# EasyEDA Pro project ProProject_扫描隧道显微镜OpenSTM_2023-08-25.epro, schematic PowerBoard
Create Date: 2022-12-16; Page Name: P1; Project Name: STM-New-Structure; Schematic Name: PowerBoard; Update Date: 2023-02-04; Add into BOM: yes; Convert to PCB: yes
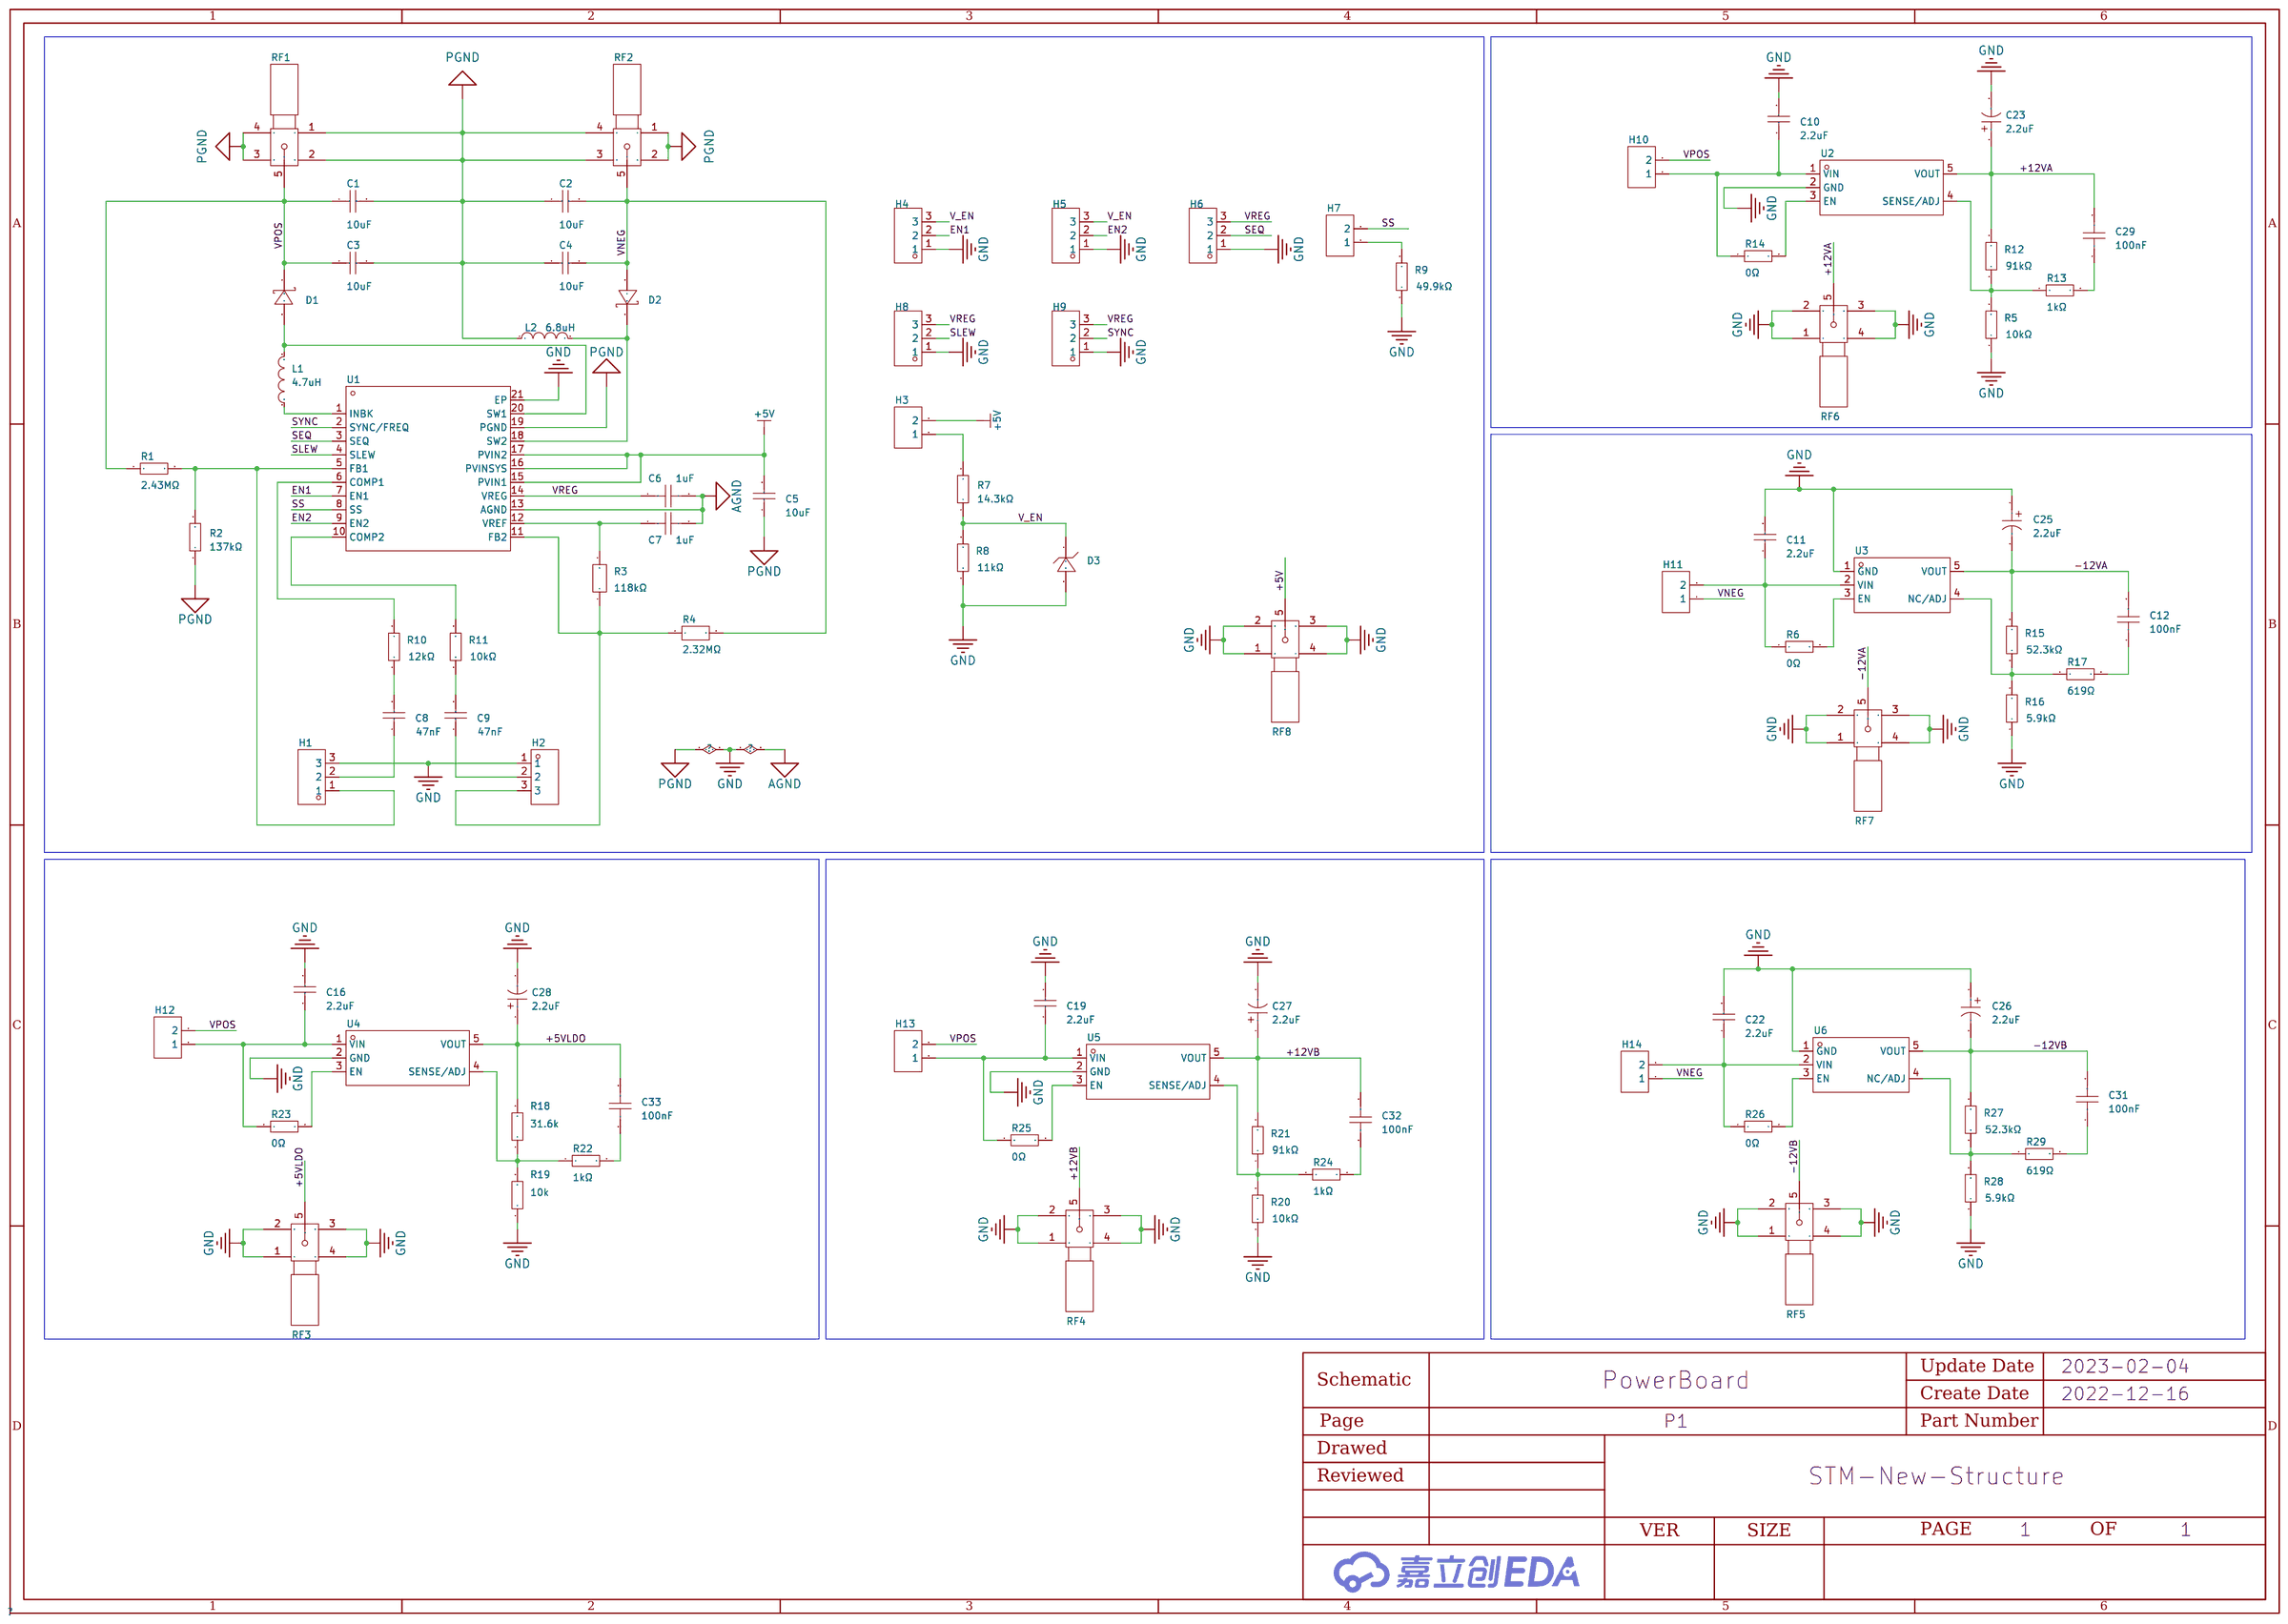
[diagram p3: schematic sheet]

## Parts
C1  10uF  [C1206]
C2  10uF  [C1206]
C3  10uF  [C1206]
C4  10uF  [C1206]
C5  10uF  [C1206]
C6  1uF  [C0603]
C7  1uF  [C0603]
C8  47nF  [C0603]
C9  47nF  [C0603]
C10  2.2uF  [C1206]
C11  2.2uF  [C1206]
C12  100nF  [C0603]
C16  2.2uF  [C1206]
C19  2.2uF  [C1206]
C22  2.2uF  [C1206]
C23  2.2uF  [CAP-SMD_L3.2-W1.6]
C25  2.2uF  [CAP-SMD_L3.2-W1.6]
C26  2.2uF  [CAP-SMD_L3.2-W1.6]
C27  2.2uF  [CAP-SMD_L3.2-W1.6]
C28  2.2uF  [CAP-SMD_L3.2-W1.6]
C29  100nF  [C0603]
C31  100nF  [C0603]
C32  100nF  [C0603]
C33  100nF  [C0603]
D1  DFLS240-7  [POWERDI-123_L2.8-W1.8-LS3.7-RD]
D2  DFLS240-7  [POWERDI-123_L2.8-W1.8-LS3.7-RD]
D3  MMSZ5233B-7-F  [SOD-123_L2.7-W1.6-LS3.7-RD]
H1  -  [HDR-TH_3P-P2.54-V-F]
H2  -  [HDR-TH_3P-P2.54-V-F]
H3  -  [HDR-TH_2P-P2.54-V-F]
H4  -  [HDR-TH_3P-P2.54-V-F]
H5  -  [HDR-TH_3P-P2.54-V-F]
H6  -  [HDR-TH_3P-P2.54-V-F]
H7  -  [HDR-TH_2P-P2.54-V-F]
H8  -  [HDR-TH_3P-P2.54-V-F]
H9  -  [HDR-TH_3P-P2.54-V-F]
H10  -  [HDR-TH_2P-P2.54-V-F]
H11  -  [HDR-TH_2P-P2.54-V-F]
H12  -  [HDR-TH_2P-P2.54-V-F]
H13  -  [HDR-TH_2P-P2.54-V-F]
H14  -  [HDR-TH_2P-P2.54-V-F]
L1  4.7uH  [IND-SMD_L5.4-W5.2]
L2  6.8uH  [IND-SMD_L7.0-W6.6]
R1  2.43MΩ  [R0603]
R2  137kΩ  [R0603]
R3  118kΩ  [R0603]
R4  2.32MΩ  [R0603]
R5  10kΩ  [R0603]
R6  0Ω  [R0603]
R7  14.3kΩ  [R0603]
R8  11kΩ  [R0603]
R9  49.9kΩ  [R0603]
R10  12kΩ  [R0603]
R11  10kΩ  [R0603]
R12  91kΩ  [R0603]
R13  1kΩ  [R0603]
R14  0Ω  [R0603]
R15  52.3kΩ  [R0603]
R16  5.9kΩ  [R0603]
R17  619Ω  [R0603]
R18  31.6k  [R0603]
R19  10k  [R0603]
R20  10kΩ  [R0603]
R21  91kΩ  [R0603]
R22  1kΩ  [R0603]
R23  0Ω  [R0603]
R24  1kΩ  [R0603]
R25  0Ω  [R0603]
R26  0Ω  [R0603]
R27  52.3kΩ  [R0603]
R28  5.9kΩ  [R0603]
R29  619Ω  [R0603]
RF1  BWSMA-KWE-Z001  [SMA-TH_BWSMA-KWE-Z001]
RF2  BWSMA-KWE-Z001  [SMA-TH_BWSMA-KWE-Z001]
RF3  BWSMA-KWE-Z001  [SMA-TH_BWSMA-KWE-Z001]
RF4  BWSMA-KWE-Z001  [SMA-TH_BWSMA-KWE-Z001]
RF5  BWSMA-KWE-Z001  [SMA-TH_BWSMA-KWE-Z001]
RF6  BWSMA-KWE-Z001  [SMA-TH_BWSMA-KWE-Z001]
RF7  BWSMA-KWE-Z001  [SMA-TH_BWSMA-KWE-Z001]
RF8  BWSMA-KWE-Z001  [SMA-TH_BWSMA-KWE-Z001]
U1  ADP5070ACPZ-R7  [LFCSP-20_L4.0-W4.0-P0.50-TL-EP2.6]
U2  ADP7118AUJZ-R7  [TSOT-23-5_L2.9-W1.6-P0.95-LS2.8-BR]
U3  ADP7182AUJZ-R7  [TSOT-23-5_L2.9-W1.6-P0.95-LS2.8-BR]
U4  ADP7118AUJZ-R7  [TSOT-23-5_L2.9-W1.6-P0.95-LS2.8-BR]
U5  ADP7118AUJZ-R7  [TSOT-23-5_L2.9-W1.6-P0.95-LS2.8-BR]
U6  ADP7182AUJZ-R7  [TSOT-23-5_L2.9-W1.6-P0.95-LS2.8-BR]

## Library data of the parts
C1-C5 = CL31A106KBHNNNE: 容值:10uF;精度:±10%;额定电压:50V;材质(温度系数):X5R;; LCSC Part Name: 10uF±10%50V; Supplier Part: C13585; Manufacturer: SAMSUNG(三星); Supplier Footprint: 1206; JLCPCB Part Class: BasicPart; Datasheet: https://atta.szlcsc.com/upload/public/pdf/source/20160103/1457707668742.pdf; Supplier: LCSC; Tolerance: ±10%; Voltage Rated: 50V; Temperature Coefficient: X5R
C6 C7 = CL10A105KL8NNNC: 容值:1uF;精度:±10%;额定电压:35V;材质(温度系数):-;; LCSC Part Name: 1uF±10%35V; Supplier Part: C478859; Manufacturer: SAMSUNG(三星); Supplier Footprint: 0603; JLCPCB Part Class: ExtendedPart; Datasheet: https://atta.szlcsc.com/upload/public/pdf/source/20200102/C478859_0EBF0387113597ECF4C91C52A34CAFD4.pdf; Supplier: LCSC; Tolerance: ±10%; Voltage Rated: 35V
C8 C9 = CL10B473KB8NNNC: 容值:47nF;精度:±10%;额定电压:50V;材质(温度系数):X7R;; LCSC Part Name: 47nF±10%50V; Supplier Part: C1622; Manufacturer: SAMSUNG(三星); Supplier Footprint: 0603; JLCPCB Part Class: BasicPart; Datasheet: https://atta.szlcsc.com/upload/public/pdf/source/20160103/1457707684971.pdf; Supplier: LCSC; Tolerance: ±10%; Voltage Rated: 50V; Temperature Coefficient: X7R
C10 C11 C16 C19 C22 = CL31B225KBHNNNE: 容值:2.2uF;精度:±10%;额定电压:50V;材质(温度系数):X7R;; LCSC Part Name: 2.2uF±10%50V; Supplier Part: C50254; Manufacturer: SAMSUNG(三星); Supplier Footprint: 1206; JLCPCB Part Class: BasicPart; Datasheet: https://atta.szlcsc.com/upload/public/pdf/source/20160103/1457707731300.pdf; Supplier: LCSC; Tolerance: ±10%; Voltage Rated: 50V; Temperature Coefficient: X7R
C12 C29 C31-C33 = CC0603KRX7R9BB104: 容值:100nF;精度:±10%;额定电压:50V;材质(温度系数):X7R;; LCSC Part Name: 100nF±10%50V; Supplier Part: C14663; Manufacturer: YAGEO(国巨); Supplier Footprint: 0603; JLCPCB Part Class: BasicPart; Datasheet: https://atta.szlcsc.com/upload/public/pdf/source/20180910/C282072_33301C7F631E79921B82A8DAC6BCC5B3.pdf; Supplier: LCSC; Tolerance: ±10%; Voltage Rated: 50V; Temperature Coefficient: X7R
C23 C25-C28 = T491A225M016AT: 容值:2.2uF;精度:±20%;额定电压:16V;漏电流:-;纹波电流:-;等效串联电阻:6Ω;工作温度:-55℃~+125℃;; LCSC Part Name: 2.2uF±20%16V; Supplier Part: C1953932; Manufacturer: KEMET(基美); Supplier Footprint: 1206; JLCPCB Part Class: ExtendedPart; Datasheet: https://atta.szlcsc.com/upload/public/pdf/source/20210416/95C0EC5B3581C9A90529545117ABEAC1.pdf; Supplier: LCSC; Tolerance: ±20%; Rated Voltage: 16V; Equivalent Series Resistance(ESR): 6Ω; Operating Temperature: -55℃~+125℃
D1 D2 = DFLS240-7: 直流反向耐压(Vr):40V;平均整流电流(Io):2A;正向压降(Vf):700mV@2A;; LCSC Part Name: 40V2A700mV@2A; Supplier Part: C124195; Manufacturer: DIODES(美台); Supplier Footprint: PowerDI-123; JLCPCB Part Class: ExtendedPart; Datasheet: https://atta.szlcsc.com/upload/public/pdf/source/20170804/C124195_1501836226603866204.pdf; Supplier: LCSC; Reverse Voltage (Vr): 40V; Average Rectified Current (Io): 2A; Forward Voltage (Vf@If): 700mV@2A
D3 = MMSZ5233B-7-F: 二极管配置:独立式;稳压值(标称值):6V;稳压值(范围):5.7V~6.3V;精度:-;功率:500mW;反向电流(Ir):5uA@3.5V;阻抗(Zzt):7Ω;; LCSC Part Name: 6V500mW; Supplier Part: C151381; Manufacturer: DIODES(美台); Supplier Footprint: SOD-123; JLCPCB Part Class: ExtendedPart; Datasheet: https://atta.szlcsc.com/upload/public/pdf/source/20171225/C151381_15141883629451203191.pdf; Supplier: LCSC; Diode Configuration: 独立式; Zener Voltage (Nom): 6V; Zener Voltage (Range): 5.7V~6.3V; Power Dissipation: 500mW; Reverse Leakage Current (Ir): 5uA@3.5V; Zener Impedance (Zzt): 7Ω
H1 H2 H4-H6 H8 H9 = HDR-F_2.54_1x3P: Supplier Part: C541850; Supplier Footprint: 插件
H3 H7 H10-H14 = HDR-F_2.54_1x2P: Supplier Part: C49661; Supplier Footprint: 插件
L1 = MWSA0503S-4R7MT: 电感值:4.7uH;精度:±20%;额定电流:4.5A;直流电阻(DCR):60mΩ;; LCSC Part Name: 4.7uH±20%4.5A60mΩ; Supplier Part: C408410; Manufacturer: Sunlord(顺络); Supplier Footprint: SMD; JLCPCB Part Class: ExtendedPart; Datasheet: https://atta.szlcsc.com/upload/public/pdf/source/20190729/C408410_8AE9F4BE330F0D24FED3825A68E3306A.pdf; Supplier: LCSC; Tolerance: ±20%; Rated Current: 4.5A; DC Resistance (DCR): 60mΩ
L2 = MWSA0603S-6R8MT: 电感值:6.8uH;精度:±20%;额定电流:5A;直流电阻(DCR):48mΩ;; LCSC Part Name: 6.8uH±20%5A48mΩ; Supplier Part: C408449; Manufacturer: Sunlord(顺络); Supplier Footprint: SMD; JLCPCB Part Class: ExtendedPart; Datasheet: https://atta.szlcsc.com/upload/public/pdf/source/20190729/C408449_00E8ADA0E11DB85AE9F292F565DACFA0.pdf; Supplier: LCSC; Tolerance: ±20%; Rated Current: 5A; DC Resistance (DCR): 48mΩ
R1 = RS-03L2434FT: 阻值:2.43MΩ;精度:±1%;功率:100mW;温度系数:±250ppm/℃;最大工作电压:50V;工作温度范围:-55℃~+155℃;; LCSC Part Name: 2.43MΩ±1%100mW; Supplier Part: C322108; Manufacturer: FH(风华); Supplier Footprint: 0603; JLCPCB Part Class: ExtendedPart; Datasheet: https://atta.szlcsc.com/upload/public/pdf/source/20181211/C322108_00DFEDFB5C93DEA336AB14E1914F72A4.pdf; Supplier: LCSC; Tolerance: ±1%; Power(Watts): 100mW; Temperature Coefficient: ±250ppm/℃; Overload Voltage (Max): 50V; Operating Temperature Range: -55℃~+155℃
R2 = 0603WAF1373T5E: 电阻类型:厚膜电阻;阻值:137kΩ;精度:±1%;功率:100mW;温度系数:±100ppm/℃;最大工作电压:75V;工作温度范围:-55℃~+155℃;; LCSC Part Name: 137kΩ±1%100mW; Supplier Part: C22872; Manufacturer: UNI-ROYAL(厚声); Supplier Footprint: 0603; JLCPCB Part Class: ExtendedPart; Datasheet: https://atta.szlcsc.com/upload/public/pdf/source/20200306/C422600_1E6D84923E4A46A82E41ADD87F860B5C.pdf; Supplier: LCSC; Type: 厚膜电阻; Tolerance: ±1%; Power(Watts): 100mW; Temperature Coefficient: ±100ppm/℃; Overload Voltage (Max): 75V; Operating Temperature Range: -55℃~+155℃
R3 = ERJ3EKF1183V: 电阻类型:厚膜电阻;阻值:118kΩ;精度:±1%;功率:100mW;温度系数:±100ppm/℃;最大工作电压:-;工作温度范围:-55℃~+155℃;; LCSC Part Name: 118kΩ±1%100mW; Supplier Part: C402896; Manufacturer: PANASONIC(松下); Supplier Footprint: 0603; JLCPCB Part Class: ExtendedPart; Datasheet: https://atta.szlcsc.com/upload/public/pdf/source/20190709/C402896_051BAD9E0EE94628DA6EDCE940A23B71.pdf; Supplier: LCSC; Type: 厚膜电阻; Tolerance: ±1%; Power(Watts): 100mW; Temperature Coefficient: ±100ppm/℃; Operating Temperature Range: -55℃~+155℃
R4 = RC0603FR-072M32L: 阻值:2.32MΩ;精度:±1%;功率:100mW;温度系数:±100ppm/℃;最大工作电压:75V;工作温度范围:-55℃~+155℃;; LCSC Part Name: 2.32MΩ±1%100mW; Supplier Part: C482791; Manufacturer: YAGEO(国巨); Supplier Footprint: 0603; JLCPCB Part Class: ExtendedPart; Datasheet: https://atta.szlcsc.com/upload/public/pdf/source/20200715/C482791_BF3B93AC40CF51E6746C24A7611E3F1E.pdf; Supplier: LCSC; Tolerance: ±1%; Power(Watts): 100mW; Temperature Coefficient: ±100ppm/℃; Overload Voltage (Max): 75V; Operating Temperature Range: -55℃~+155℃
R5 R11 R20 = 0603WAF1002T5E: 电阻类型:厚膜电阻;阻值:10kΩ;精度:±1%;功率:100mW;温度系数:±100ppm/℃;最大工作电压:75V;工作温度范围:-55℃~+155℃;; LCSC Part Name: 10kΩ±1%100mW; Supplier Part: C25804; Manufacturer: UNI-ROYAL(厚声); Supplier Footprint: 0603; JLCPCB Part Class: BasicPart; Datasheet: https://atta.szlcsc.com/upload/public/pdf/source/20200306/C422600_1E6D84923E4A46A82E41ADD87F860B5C.pdf; Supplier: LCSC; Type: 厚膜电阻; Tolerance: ±1%; Power(Watts): 100mW; Temperature Coefficient: ±100ppm/℃; Overload Voltage (Max): 75V; Operating Temperature Range: -55℃~+155℃
R6 R14 R23 R25 R26 = 0603WAF0000T5E: 电阻类型:厚膜电阻;阻值:0Ω;精度:±1%;功率:100mW;最大工作电压:75V;工作温度范围:-55℃~+155℃;; LCSC Part Name: 0Ω±1%100mW; Supplier Part: C21189; Manufacturer: UNI-ROYAL(厚声); Supplier Footprint: 0603; JLCPCB Part Class: BasicPart; Datasheet: https://atta.szlcsc.com/upload/public/pdf/source/20200306/C422600_1E6D84923E4A46A82E41ADD87F860B5C.pdf; Supplier: LCSC; Type: 厚膜电阻; Tolerance: ±1%; Power(Watts): 100mW; Overload Voltage (Max): 75V; Operating Temperature Range: -55℃~+155℃
R7 = 0603WAF1432T5E: 电阻类型:厚膜电阻;阻值:14.3kΩ;精度:±1%;功率:100mW;温度系数:±100ppm/℃;最大工作电压:75V;工作温度范围:-55℃~+155℃;; LCSC Part Name: 14.3kΩ±1%100mW; Supplier Part: C22799; Manufacturer: UNI-ROYAL(厚声); Supplier Footprint: 0603; JLCPCB Part Class: ExtendedPart; Datasheet: https://atta.szlcsc.com/upload/public/pdf/source/20200306/C422600_1E6D84923E4A46A82E41ADD87F860B5C.pdf; Supplier: LCSC; Type: 厚膜电阻; Tolerance: ±1%; Power(Watts): 100mW; Temperature Coefficient: ±100ppm/℃; Overload Voltage (Max): 75V; Operating Temperature Range: -55℃~+155℃
R8 = 0603WAF1102T5E: 电阻类型:厚膜电阻;阻值:11kΩ;精度:±1%;功率:100mW;温度系数:±100ppm/℃;最大工作电压:75V;工作温度范围:-55℃~+155℃;; LCSC Part Name: 11kΩ±1%100mW; Supplier Part: C25950; Manufacturer: UNI-ROYAL(厚声); Supplier Footprint: 0603; JLCPCB Part Class: BasicPart; Datasheet: https://atta.szlcsc.com/upload/public/pdf/source/20200306/C422600_1E6D84923E4A46A82E41ADD87F860B5C.pdf; Supplier: LCSC; Type: 厚膜电阻; Tolerance: ±1%; Power(Watts): 100mW; Temperature Coefficient: ±100ppm/℃; Overload Voltage (Max): 75V; Operating Temperature Range: -55℃~+155℃
R9 = 0603WAF4992T5E: 电阻类型:厚膜电阻;阻值:49.9kΩ;精度:±1%;功率:100mW;温度系数:±100ppm/℃;最大工作电压:75V;工作温度范围:-55℃~+155℃;; LCSC Part Name: 49.9kΩ±1%100mW; Supplier Part: C23184; Manufacturer: UNI-ROYAL(厚声); Supplier Footprint: 0603; JLCPCB Part Class: BasicPart; Datasheet: https://atta.szlcsc.com/upload/public/pdf/source/20200306/C422600_1E6D84923E4A46A82E41ADD87F860B5C.pdf; Supplier: LCSC; Type: 厚膜电阻; Tolerance: ±1%; Power(Watts): 100mW; Temperature Coefficient: ±100ppm/℃; Overload Voltage (Max): 75V; Operating Temperature Range: -55℃~+155℃
R10 = 0603WAF1202T5E: 电阻类型:厚膜电阻;阻值:12kΩ;精度:±1%;功率:100mW;温度系数:±100ppm/℃;最大工作电压:75V;工作温度范围:-55℃~+155℃;; LCSC Part Name: 12kΩ±1%100mW; Supplier Part: C22790; Manufacturer: UNI-ROYAL(厚声); Supplier Footprint: 0603; JLCPCB Part Class: BasicPart; Datasheet: https://atta.szlcsc.com/upload/public/pdf/source/20200306/C422600_1E6D84923E4A46A82E41ADD87F860B5C.pdf; Supplier: LCSC; Type: 厚膜电阻; Tolerance: ±1%; Power(Watts): 100mW; Temperature Coefficient: ±100ppm/℃; Overload Voltage (Max): 75V; Operating Temperature Range: -55℃~+155℃
R12 R21 = 0603WAF9102T5E: 电阻类型:厚膜电阻;阻值:91kΩ;精度:±1%;功率:100mW;温度系数:±100ppm/℃;最大工作电压:75V;工作温度范围:-55℃~+155℃;; LCSC Part Name: 91kΩ±1%100mW; Supplier Part: C23265; Manufacturer: UNI-ROYAL(厚声); Supplier Footprint: 0603; JLCPCB Part Class: BasicPart; Datasheet: https://atta.szlcsc.com/upload/public/pdf/source/20200306/C422600_1E6D84923E4A46A82E41ADD87F860B5C.pdf; Supplier: LCSC; Type: 厚膜电阻; Tolerance: ±1%; Power(Watts): 100mW; Temperature Coefficient: ±100ppm/℃; Overload Voltage (Max): 75V; Operating Temperature Range: -55℃~+155℃
R13 R22 R24 = 0603WAF1001T5E: 电阻类型:厚膜电阻;阻值:1kΩ;精度:±1%;功率:100mW;温度系数:±100ppm/℃;最大工作电压:75V;工作温度范围:-55℃~+155℃;; LCSC Part Name: 1kΩ±1%100mW; Supplier Part: C21190; Manufacturer: UNI-ROYAL(厚声); Supplier Footprint: 0603; JLCPCB Part Class: BasicPart; Datasheet: https://atta.szlcsc.com/upload/public/pdf/source/20200306/C422600_1E6D84923E4A46A82E41ADD87F860B5C.pdf; Supplier: LCSC; Type: 厚膜电阻; Tolerance: ±1%; Power(Watts): 100mW; Temperature Coefficient: ±100ppm/℃; Overload Voltage (Max): 75V; Operating Temperature Range: -55℃~+155℃
R15 R27 = 0603WAF5232T5E: 电阻类型:厚膜电阻;阻值:52.3kΩ;精度:±1%;功率:100mW;温度系数:±100ppm/℃;最大工作电压:75V;工作温度范围:-55℃~+155℃;; LCSC Part Name: 52.3kΩ±1%100mW; Supplier Part: C23198; Manufacturer: UNI-ROYAL(厚声); Supplier Footprint: 0603; JLCPCB Part Class: ExtendedPart; Datasheet: https://atta.szlcsc.com/upload/public/pdf/source/20200306/C422600_1E6D84923E4A46A82E41ADD87F860B5C.pdf; Supplier: LCSC; Type: 厚膜电阻; Tolerance: ±1%; Power(Watts): 100mW; Temperature Coefficient: ±100ppm/℃; Overload Voltage (Max): 75V; Operating Temperature Range: -55℃~+155℃
R16 R28 = 0603WAF5901T5E: 电阻类型:厚膜电阻;阻值:5.9kΩ;精度:±1%;功率:100mW;温度系数:±100ppm/℃;最大工作电压:75V;工作温度范围:-55℃~+155℃;; LCSC Part Name: 5.9kΩ±1%100mW; Supplier Part: C23071; Manufacturer: UNI-ROYAL(厚声); Supplier Footprint: 0603; JLCPCB Part Class: ExtendedPart; Datasheet: https://atta.szlcsc.com/upload/public/pdf/source/20200306/C422600_1E6D84923E4A46A82E41ADD87F860B5C.pdf; Supplier: LCSC; Type: 厚膜电阻; Tolerance: ±1%; Power(Watts): 100mW; Temperature Coefficient: ±100ppm/℃; Overload Voltage (Max): 75V; Operating Temperature Range: -55℃~+155℃
R17 R29 = 0603WAF6190T5E: 电阻类型:厚膜电阻;阻值:619Ω;精度:±1%;功率:100mW;温度系数:±100ppm/℃;最大工作电压:75V;工作温度范围:-55℃~+155℃;; LCSC Part Name: 619Ω±1%100mW; Supplier Part: C23218; Manufacturer: UNI-ROYAL(厚声); Supplier Footprint: 0603; JLCPCB Part Class: ExtendedPart; Datasheet: https://atta.szlcsc.com/upload/public/pdf/source/20200306/C422600_1E6D84923E4A46A82E41ADD87F860B5C.pdf; Supplier: LCSC; Type: 厚膜电阻; Tolerance: ±1%; Power(Watts): 100mW; Temperature Coefficient: ±100ppm/℃; Overload Voltage (Max): 75V; Operating Temperature Range: -55℃~+155℃
R18 = 0603WAF3162T5E: 电阻类型:厚膜电阻;阻值:31.6k;精度:±1%;功率:1/10W;温度系数:±100ppm/;最大工作电压:75V;工作温度范围:-55~+155;; LCSC Part Name: 31.6k ±1%; Supplier Part: C25967; Manufacturer: UNI-ROYAL(厚声); Supplier Footprint: 0603; JLCPCB Part Class: ExtendedPart; Datasheet: https://atta.szlcsc.com/upload/public/pdf/source/20200306/C422600_1E6D84923E4A46A82E41ADD87F860B5C.pdf; Supplier: LCSC; Type: 厚膜电阻; Tolerance: ±1%; Power(Watts): 1/10W; Temperature Coefficient: ±100ppm/; Overload Voltage (Max): 75V; Operating Temperature Range: -55~+155
R19 = 0603WAF1002T5E: 电阻类型:厚膜电阻;阻值:10k;精度:±1%;功率:1/10W;温度系数:±100ppm/;最大工作电压:75V;工作温度范围:-55~+155;; LCSC Part Name: 10k ±1%; Supplier Part: C25804; Manufacturer: UNI-ROYAL(厚声); Supplier Footprint: 0603; JLCPCB Part Class: BasicPart; Datasheet: https://atta.szlcsc.com/upload/public/pdf/source/20200306/C422600_1E6D84923E4A46A82E41ADD87F860B5C.pdf; Supplier: LCSC; Type: 厚膜电阻; Tolerance: ±1%; Power(Watts): 1/10W; Temperature Coefficient: ±100ppm/; Overload Voltage (Max): 75V; Operating Temperature Range: -55~+155
RF1-RF8 = BWSMA-KWE-Z001: 连接器类型:板端;射频系列:SMA;接口类型:内孔;端口数量:1;阻抗:-;频率-最大值:-;样式:弯头;接口直径:5.3mm;接口长度/高度:-;工作温度范围:-;; LCSC Part Name: SMA内孔弯头SMA天线座SMA弯头正脚板端座子; Supplier Part: C496551; Manufacturer: BATWIRELESS(蝙蝠无线); Supplier Footprint: 插件; JLCPCB Part Class: ExtendedPart; Datasheet: https://atta.szlcsc.com/upload/public/pdf/source/20201015/C496551_6AE7B02D24D60B4F78A8937E4C4F8093.pdf; Supplier: LCSC; Connector Type: 板端; RF Series: SMA; Interface Type: 内孔; Number of Ports: 1; Style: 弯头; Interface Diameter: 5.3mm
U1 = ADP5070ACPZ-R7: Supplier Part: C659268; Manufacturer: ADI(亚德诺)/LINEAR(凌特); Supplier Footprint: LFCSP-20; JLCPCB Part Class: ExtendedPart; Datasheet: https://atta.szlcsc.com/upload/public/pdf/source/20201201/C659267_82167F50DBE1C877169DF4968FFAEF20.pdf; Supplier: LCSC
U2 U4 U5 = ADP7118AUJZ-R7: 输出类型:-;; Supplier Part: C514355; Manufacturer: ADI(亚德诺)/LINEAR; Supplier Footprint: TSOT-5; JLCPCB Part Class: ExtendedPart; Datasheet: https://atta.szlcsc.com/upload/public/pdf/source/20180628/C194022_239F12D87A493F0A2DF0E3CFBC8CAC3D.pdf; Supplier: LCSC
U3 U6 = ADP7182AUJZ-R7: 输出类型:-;; Supplier Part: C514358; Manufacturer: ADI(亚德诺)/LINEAR; Supplier Footprint: TSOT-23-5; JLCPCB Part Class: ExtendedPart; Datasheet: https://atta.szlcsc.com/upload/public/pdf/source/20200415/C514357_C62C5F16D10E6100853AA0BDD3A28C3C.pdf; Supplier: LCSC

## Nets
+5V: C5.2 H3.2 RF8.5 U1.15(PVIN1) U1.16(PVINSYS) U1.17(PVIN2)
+5VLDO: C28.1 C33.2 R18.2 RF3.5 U4.5(VOUT)
+12VA: C23.1 C29.2 R12.2 RF6.5 U2.5(VOUT)
+12VB: C27.1 C32.2 R21.2 RF4.5 U5.5(VOUT)
-12VA: C12.2 C25.2 R15.2 RF7.5 U3.5(VOUT)
-12VB: C26.2 C31.2 R27.2 RF5.5 U6.5(VOUT)
AGND: C1.2 C2.1 C3.2 C4.1 C5.1 C6.2 C7.2 C10.2 C11.2 C16.2 C19.2 C22.2 C23.2 C25.1 C26.1 C27.2 C28.2 D3.2(A) H1.3 H2.1 H4.1 H5.1 H6.1 H8.1 H9.1 L2.1 R2.1 R5.1 R8.1 R9.1 R16.1 R19.1 R20.1 R28.1 RF1.1 RF1.2 RF1.3 RF1.4 RF2.1 RF2.2 RF2.3 RF2.4 RF3.1 RF3.2 RF3.3 RF3.4 RF4.1 RF4.2 RF4.3 RF4.4 RF5.1 RF5.2 RF5.3 RF5.4 RF6.1 RF6.2 RF6.3 RF6.4 RF7.1 RF7.2 RF7.3 RF7.4 RF8.1 RF8.2 RF8.3 RF8.4 U1.13(AGND) U1.19(PGND) U1.21(EP) U2.2(GND) U3.1(GND) U4.2(GND) U5.2(GND) U6.1(GND)
EN1: H4.2 U1.7(EN1)
EN2: H5.2 U1.9(EN2)
SEQ: H6.2 U1.3(SEQ)
SLEW: H8.2 U1.4(SLEW)
SS: H7.2 U1.8(SS)
SYNC: H9.2 U1.2(SYNC/FREQ)
V_EN: D3.1(C) H4.3 H5.3 R7.1 R8.2
VNEG: C2.2 C4.2 D2.2(A) H11.1 H14.1 R4.2 RF2.5
VPOS: C1.1 C3.1 D1.1(C) H10.2 H12.2 H13.2 R1.1 RF1.5
VREG: C6.1 H6.3 H8.3 H9.3 U1.14(VREG)
$1N2268: L1.1 U1.1(INBK)
$1N2301: D1.2(A) L1.2 U1.20(SW1)
$1N2768: D2.1(C) L2.2 U1.18(SW2)
$1N4863: C7.1 R3.2 U1.12(VREF)
$1N5027: H1.1 R1.2 R2.2 U1.5(FB1)
$1N5900: H2.3 R3.1 R4.1 U1.11(FB2)
$1N6634: R10.2 U1.6(COMP1)
$1N6660: R11.2 U1.10(COMP2)
$1N6686: C8.2 R10.1
$1N6748: C9.2 R11.1
$1N7096: C8.1 H1.2
$1N7120: C9.1 H2.2
$1N10840: H3.1 R7.2
$1N12151: H7.1 R9.2
$1N13840: R14.2 U2.3(EN)
$1N15786: R5.2 R12.1 R13.1 U2.4(SENSE/ADJ)
$1N16226: C29.1 R13.2
$1N17984: C10.1 H10.1 R14.1 U2.1(VIN)
$1N19681: C11.1 H11.2 R6.1 U3.2(VIN)
$1N20044: R6.2 U3.3(EN)
$1N21295: R15.1 R16.2 R17.1 U3.4(NC/ADJ)
$1N21739: C12.1 R17.2
$1N22287: C33.1 R22.2
$1N22288: R18.1 R19.2 R22.1 U4.4(SENSE/ADJ)
$1N22290: R23.2 U4.3(EN)
$1N22291: C16.1 H12.1 R23.1 U4.1(VIN)
$1N23227: C32.1 R24.2
$1N23228: R20.2 R21.1 R24.1 U5.4(SENSE/ADJ)
$1N23230: R25.2 U5.3(EN)
$1N23231: C19.1 H13.1 R25.1 U5.1(VIN)
$1N24074: R26.2 U6.3(EN)
$1N24075: C22.1 H14.2 R26.1 U6.2(VIN)
$1N24078: R27.1 R28.2 R29.1 U6.4(NC/ADJ)
$1N24079: C31.1 R29.2
